# EasyEDA Pro project ProPrj_STM32音响_2025-06-08.epro, schematic 单片机及附属设备

## Sheets
1 INA226&ADS1115: Board Name: PCB6; Create Date: 2025-03-31; Page Name: INA226&ADS1115; Project Name: STM32多功能音响; Schematic Name: 单片机及附属设备; Update Date: 2025-05-01; Company: 嘉立创EDA; Page Size: A4; Version: V1.0
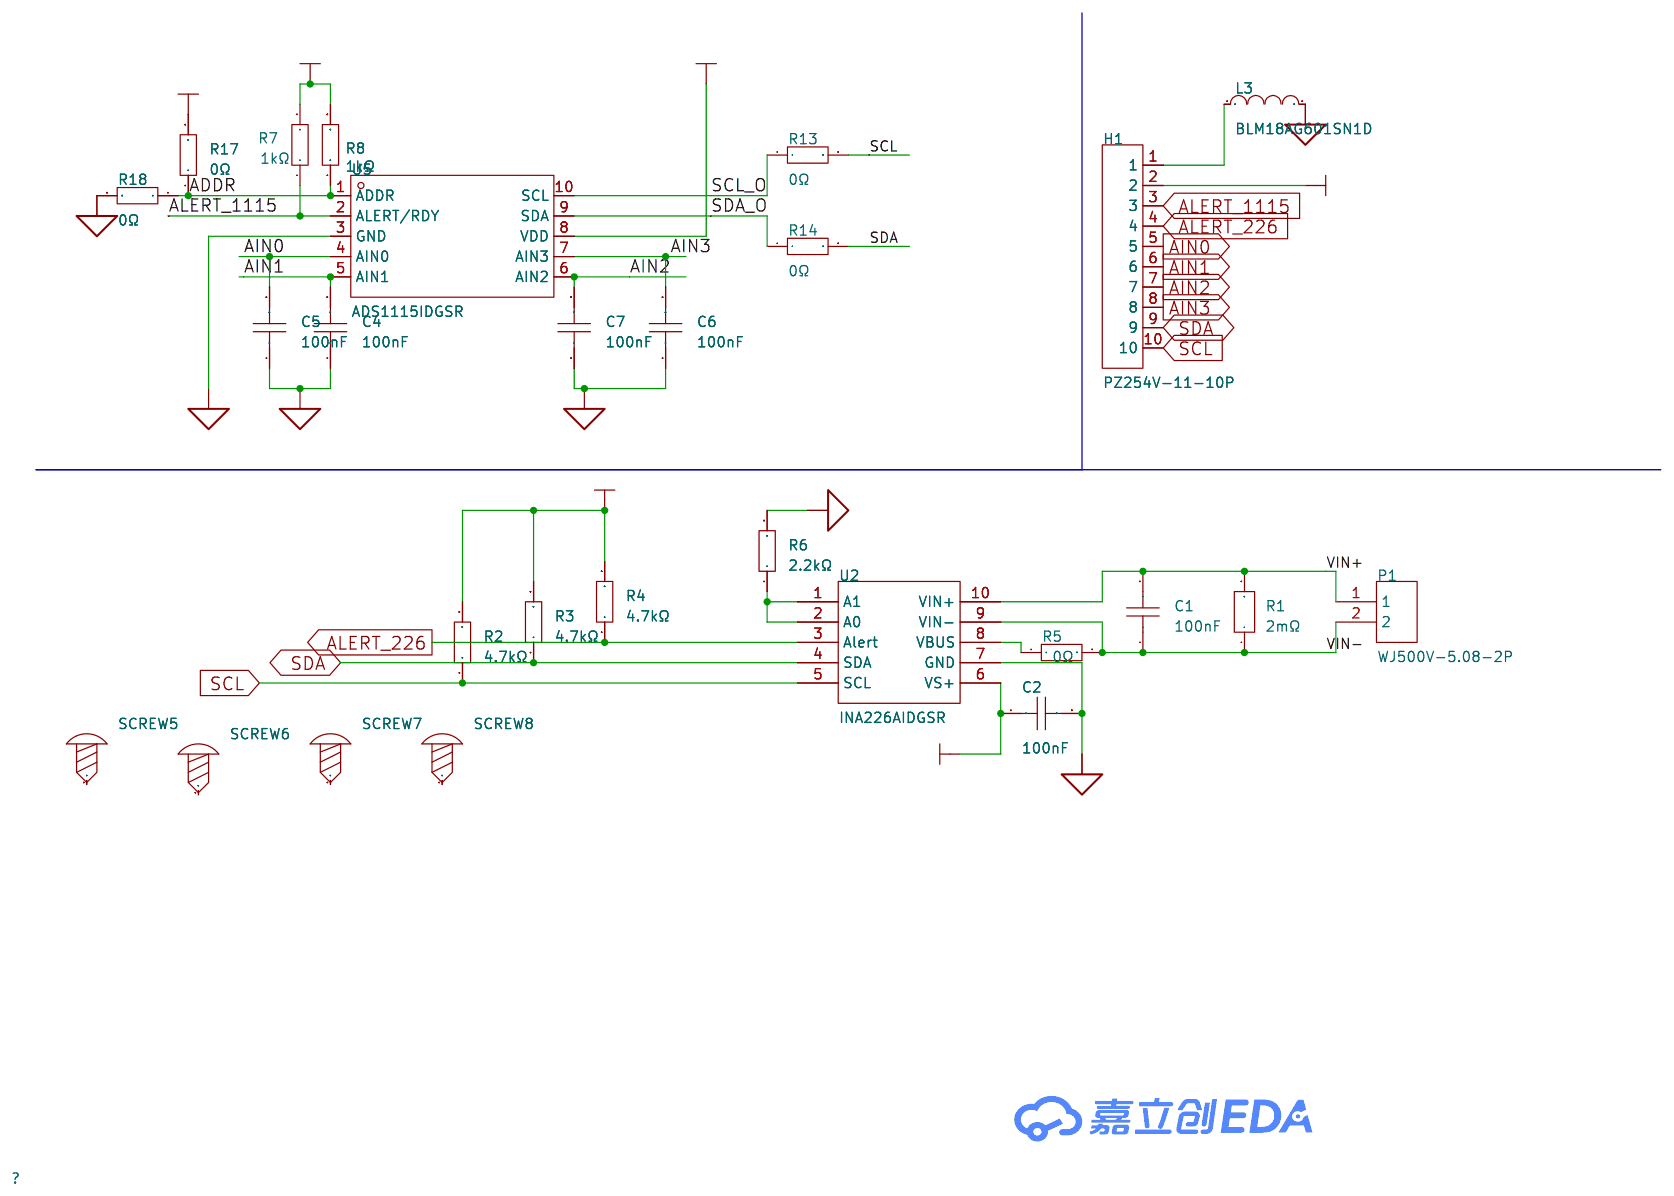
[diagram p13: INA226&ADS1115]
2 音频选择&蓝牙接收&3.3V: Create Date: 2025-05-08; Page Name: P1; Update Date: 2025-05-09
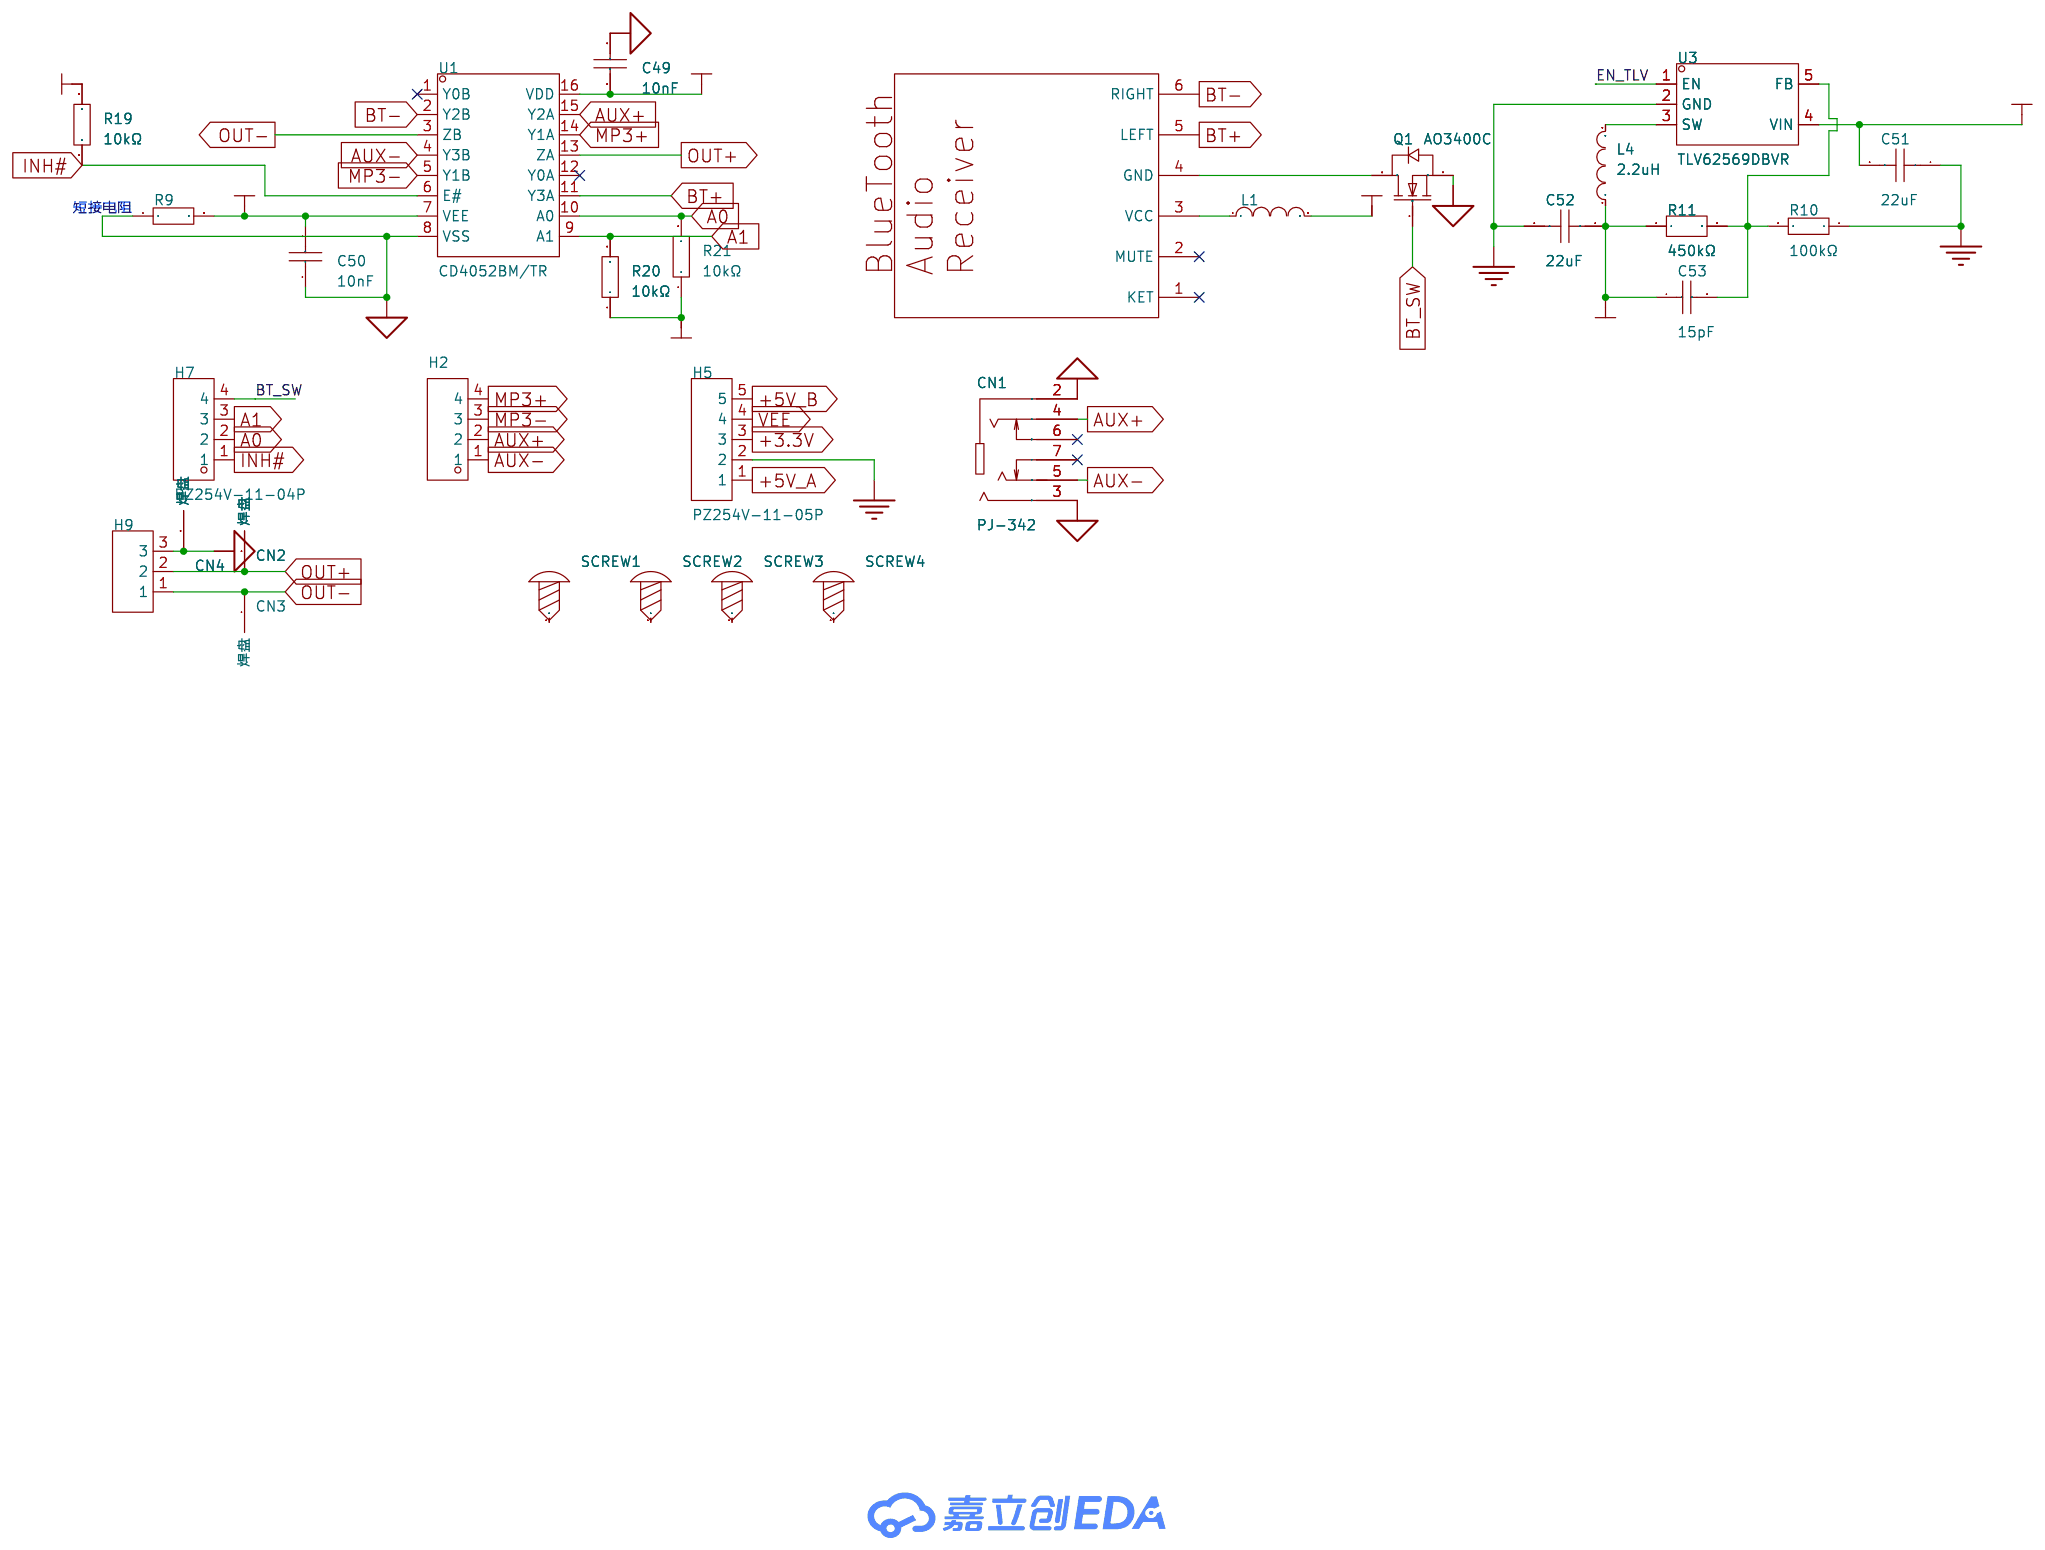
[diagram p14: 音频选择&蓝牙接收&3.3V]

## Parts
sheet INA226&ADS1115
C1  100nF  [C0603]
C2  100nF  [C0603]
C4  100nF  [C0603]
C5  100nF  [C0603]
C6  100nF  [C0603]
C7  100nF  [C0603]
H1  PZ254V-11-10P  [HDR-TH_10P-P2.54-V-M]
L3  BLM18AG601SN1D  [L0603]
P1  WJ500V-5.08-2P  [CONN-TH_2P-P5.00_WJ500V-5.08-2P]
R1  2mΩ  [RES-SMD_L6.4-W3.2-1]
R2  4.7kΩ  [R0603]
R3  4.7kΩ  [R0603]
R4  4.7kΩ  [R0603]
R5  0Ω  [R1206]
R6  2.2kΩ  [R0603]
R7  1kΩ  [R0603]
R8  1kΩ  [R0603]
R13  0Ω  [R0603]
R14  0Ω  [R0603]
R17  0Ω  [R0603]
R18  0Ω  [R0603]
SCREW5  -  [M2螺丝]
SCREW6  -  [M2螺丝]
SCREW7  -  [M2螺丝]
SCREW8  -  [M2螺丝]
U2  INA226AIDGSR  [MSOP-10_L3.0-W3.0-P0.50-LS5.0-BL]
U5  ADS1115IDGSR  [MSOP-10_L3.0-W3.0-P0.50-LS5.0-BL]
sheet 音频选择&蓝牙接收&3.3V
C49  10nF  [C0603]
C50  10nF  [C0603]
C51  22uF  [C1206]
C52  22uF  [C1206]
C53  15pF  [C0603]
CN1  PJ-342  [AUDIO-SMD_PJ-342]
CN2  -  [长圆穿孔焊盘 4-2_1.5-0.75]
CN3  -  [长圆穿孔焊盘 4-2_1.5-0.75]
CN4  -  [长圆穿孔焊盘 4-2_1.5-0.75]
H2  PZ254V-11-04P  [HDR-TH_4P-P2.54-V-M]
H5  PZ254V-11-05P  [HDR-TH_5P-P2.54-V-M]
H7  PZ254V-11-04P  [HDR-TH_4P-P2.54-V-M]
H9  PZ254V-11-03P  [HDR-TH_3P-P2.54-V-M]
L1  BLM18AG601SN1D  [L0603]
L4  2.2uH  [IND-SMD_L7.0-W6.6]
Q1  AO3400C  [SOT-23-3_L2.9-W1.3-P1.90-LS2.4-BR]
R9  0Ω  [R0603]
R10  100kΩ  [R0603]
R11  450kΩ  [R0603]
R19  10kΩ  [R0603]
R20  10kΩ  [R0603]
R21  10kΩ  [R0603]
SCREW1  -  [M2螺丝]
SCREW2  -  [M2螺丝]
SCREW3  -  [M2螺丝]
SCREW4  -  [M2螺丝]
U1  CD4052BM/TR  [SOP-16_L10.0-W3.9-P1.27-LS6.0-BL]
U3  TLV62569DBVR  [SOT-23-5_L3.0-W1.7-P0.95-LS2.8-BR]
U4  -  [M18蓝牙接收器焊盘]

## Library data of the parts
C1 C2 = CGA0603X7R104K500JT: 容值:100nF;精度:±10%;额定电压:50V;材质(温度系数):X7R;; LCSC Part Name: 100nF ±10% 50V; Supplier Part: C6119867; Manufacturer: HRE(芯声); Supplier Footprint: 0603; JLCPCB Part Class: Extended Part; Supplier: LCSC; Tolerance: ±10%; Voltage Rated: 50V; Temperature Coefficient: X7R
C4-C7 = CGA0603X7R104K500JT: 容值:100nF;精度:±10%;额定电压:50V;温度系数:X7R;; LCSC Part Name: 100nF ±10% 50V; Supplier Part: C6119867; Manufacturer: HRE(芯声); Supplier Footprint: 0603; JLCPCB Part Class: Extended Part; Datasheet: https://atta.szlcsc.com/upload/public/pdf/source/20250103/C44077DA9E7B3EFAE02F22B6D3D1CBC9.pdf; Supplier: LCSC; Tolerance: ±10%; Voltage Rated: 50V; Temperature Coefficient: X7R; Voltage Rating: 50V
H1 = PZ254V-11-10P: 插针结构:1x10P;间距:2.54mm;行距:-;圆针/方针:方针;安装方式:直插;排数:单排;总PIN位数:10P;额定电流:-;额定电压:-;配合针长度:6mm;塑高:2.5mm;端接针长度:3mm;触头材质:黄铜;触头镀层:-;工作温度:-40℃~+105℃;颜色:黑色;; LCSC Part Name: 1x10P 间距:2.54mm 方针 直插; Supplier Part: C492409; Manufacturer: XFCN(兴飞); Supplier Footprint: 插件,P=2.54mm; JLCPCB Part Class: Extended Part; Datasheet: https://atta.szlcsc.com/upload/public/pdf/source/20200309/C492409_129C9431BDD62EBBBD0A643B6AAB9FBD.pdf; Supplier: LCSC; Pin Structure: 1x10P; Pitch: 2.54mm; Circluar Pins/Square Pins: 方针; Mounting Type: 直插; Number of Rows: 单排; Number of Pins: 10P; Length of Mating Pin: 6mm; Insulation Height: 2.5mm; Length of End Connection Pin: 3mm; Contact Material: 黄铜; Operating Temperature: -40℃~+105℃; Color: 黑色
L1 L3 = BLM18AG601SN1D: 标称阻抗@测试频率:600Ω@100MHz;误差:±25%;直流电阻(RDC):380mΩ;; LCSC Part Name: 单路 0603磁珠 阻抗600Ω@100MHz; Supplier Part: C19330; Manufacturer: muRata(村田); Supplier Footprint: 0603; JLCPCB Part Class: 扩展库; Datasheet: https://atta.szlcsc.com/upload/public/pdf/source/20180329/C160981_FD3C2D2622A377E203B89F4AA32B0741.pdf; Supplier: LCSC; Impedance @ Frequency: 600Ω@100MHz; Tolerance: ±25%; DC Resistance: 380mΩ; Current Rating: 500mA; Circuits: 1
P1 = WJ500V-5.08-2P: 结构:1x2P;间距:5.08mm;颜色:绿色;安装方式:直插;额定电流:18A;额定电压:250V;排数:1;线规 - AWG:14~30;线规 - 平方毫米:2.5;每排PIN数:2;触头材质:-;触头镀层:-;工作温度范围:-40℃~+105℃;焊接温度(最大值):-;; LCSC Part Name: 1x2P 5.08mm 直插 排数:1 每排P数:2; Supplier Part: C8465; Manufacturer: KANGNEX(康奈克斯电气); Supplier Footprint: 插件,P=5.08mm; JLCPCB Part Class: 扩展库; Datasheet: https://atta.szlcsc.com/upload/public/pdf/source/20191225/C8465_02D34CE5B5B4A53DF5891601D97FA9F4.pdf; Supplier: LCSC; Structure: 1x2P; Pitch: 5.08mm; Color: 绿色; Mounting Style: 直插; Current Rating (Max): 18A; Voltage Rating (Max): 250V; Number of Pins: 2P; Number of Rows: 1; Wire Gauge - AWG: 14~30; Wire Gauge - mm2: 2.5; Number of PINs Per Row: 2; Operating Temperature Range: -40℃~+105℃; Screw Specification: M2.5
R1 = HoLLR2512-3W-2mR-1%: 电阻类型:采样电阻;阻值:2mΩ;精度:±1%;额定压降:-;功率:3W;温度系数:±50ppm/℃;安装方式:贴片;; LCSC Part Name: 2mΩ ±1% 3W; Supplier Part: C2994640; Manufacturer: Milliohm(毫欧); Supplier Footprint: 2512; JLCPCB Part Class: Extended Part; Datasheet: https://atta.szlcsc.com/upload/public/pdf/source/20220330/9E8D3880B1628B3B70C68092C8A7E08B.pdf; Supplier: LCSC; Type: 采样电阻; Tolerance: ±1%; Power(Watts): 3W; Rated Current: 77.5A; Temperature Coefficient: ±50ppm/℃; Mounting Sytle: 贴片
R2-R4 = 0603WAF4701T5E: 电阻类型:厚膜电阻;阻值:4.7kΩ;精度:±1%;功率:100mW;最大工作电压:75V;温度系数:±100ppm/℃;; LCSC Part Name: 4.7kΩ ±1% 100mW 厚膜电阻; Supplier Part: C23162; Manufacturer: UNI-ROYAL(厚声); Supplier Footprint: 0603; JLCPCB Part Class: 基础库; Datasheet: https://atta.szlcsc.com/upload/public/pdf/source/20200306/C422600_1E6D84923E4A46A82E41ADD87F860B5C.pdf; Supplier: LCSC; Type: 厚膜电阻; Tolerance: ±1%; Power(Watts): 100mW; Overload Voltage (Max): 75V; Temperature Coefficient: ±100ppm/℃; Operating Temperature Range: -55℃~+155℃
R5 = 1206W4F0000T5E: 电阻类型:厚膜电阻;阻值:0Ω;精度:±1%;功率:250mW;最大工作电压:200V;温度系数:±800ppm/℃;; LCSC Part Name: 0Ω ±1% 250mW 厚膜电阻; Supplier Part: C17888; Manufacturer: UNI-ROYAL(厚声); Supplier Footprint: 1206; JLCPCB Part Class: 基础库; Datasheet: https://atta.szlcsc.com/upload/public/pdf/source/20200306/C422600_1E6D84923E4A46A82E41ADD87F860B5C.pdf; Supplier: LCSC; Type: 厚膜电阻; Tolerance: ±1%; Power(Watts): 250mW; Overload Voltage (Max): 200V; Temperature Coefficient: ±800ppm/℃; Operating Temperature Range: -55℃~+155℃
R6 = 0603WAF2201T5E: 电阻类型:厚膜电阻;阻值:2.2kΩ;精度:±1%;功率:100mW;最大工作电压:75V;温度系数:±100ppm/℃;; LCSC Part Name: 2.2kΩ ±1% 100mW 厚膜电阻; Supplier Part: C4190; Manufacturer: UNI-ROYAL(厚声); Supplier Footprint: 0603; JLCPCB Part Class: Basic Part; Datasheet: https://atta.szlcsc.com/upload/public/pdf/source/20200306/C422600_1E6D84923E4A46A82E41ADD87F860B5C.pdf; Supplier: LCSC; Type: 厚膜电阻; Tolerance: ±1%; Power(Watts): 100mW; Overload Voltage (Max): 75V; Temperature Coefficient: ±100ppm/℃; Operating Temperature Range: -55℃~+155℃
R7 R8 = 0603WAF1001T5E: 电阻类型:厚膜电阻;阻值:1kΩ;精度:±1%;功率:100mW;最大工作电压:75V;温度系数:±100ppm/℃;; LCSC Part Name: 1kΩ ±1% 100mW 厚膜电阻; Supplier Part: C21190; Manufacturer: UNI-ROYAL(厚声); Supplier Footprint: 0603; JLCPCB Part Class: Basic Part; Datasheet: https://atta.szlcsc.com/upload/public/pdf/source/20200306/C422600_1E6D84923E4A46A82E41ADD87F860B5C.pdf; Supplier: LCSC; Type: 厚膜电阻; Tolerance: ±1%; Power(Watts): 100mW; Overload Voltage (Max): 75V; Temperature Coefficient: ±100ppm/℃; Operating Temperature Range: -55℃~+155℃
R9 R13 R14 R17 R18 = 0603WAF0000T5E: 电阻类型:厚膜电阻;阻值:0Ω;精度:±1%;功率:100mW;最大工作电压:75V;; LCSC Part Name: 0Ω ±1% 100mW 厚膜电阻; Supplier Part: C21189; Manufacturer: UNI-ROYAL(厚声); Supplier Footprint: 0603; JLCPCB Part Class: 基础库; Datasheet: https://atta.szlcsc.com/upload/public/pdf/source/20200306/C422600_1E6D84923E4A46A82E41ADD87F860B5C.pdf; Supplier: LCSC; Type: 厚膜电阻; Tolerance: ±1%; Power(Watts): 100mW; Overload Voltage (Max): 75V; Operating Temperature Range: -55℃~+155℃
SCREW1-SCREW8 = M2螺丝: Supplier Footprint: 插件
U2 = INA226AIDGSR: INA226 支持报警功能的 36V、双向、超高精度、低侧/高侧、I2C 输出电流/功率监控器; Supplier Part: C49851; Manufacturer: TI(德州仪器); Supplier Footprint: MSOP-10; JLCPCB Part Class: Extended Part; Datasheet: https://www.ti.com/cn/lit/gpn/ina226; Supplier: LCSC; Supply Voltage: 0V~36V; Operating Temperature: -40℃~+125℃
U5 = ADS1115IDGSR: 接口:I2C;电源电压:2V~5.5V;采样率:860Hz;分辨率:16位;; LCSC Part Name: 具有内部基准、振荡器和可编程比较器且兼容 I2C 的ADS111x、超小型、低功耗 860SPS、16位ADC; Supplier Part: C37593; Manufacturer: TI(德州仪器); Supplier Footprint: VSSOP-10; JLCPCB Part Class: 扩展库; Datasheet: https://www.ti.com/cn/lit/gpn/ads1115; Supplier: LCSC; Interface: I2C; differential input: 是; number of channels: 2; Supply Voltage: 2V~5.5V; sampling frequency: 860Hz; resolution: 16位; Operating Temperature: -40℃~+125℃
C49 C50 = CC0603KRX7R9BB103: 容值:10nF;精度:±10%;额定电压:50V;材质(温度系数):X7R;; LCSC Part Name: 10nF ±10% 50V; Supplier Part: C100042; Manufacturer: YAGEO(国巨); Supplier Footprint: 0603; JLCPCB Part Class: 扩展库; Datasheet: https://atta.szlcsc.com/upload/public/pdf/source/20181008/C309510_22F155564471FAF6A489F7D68F34234E.pdf; Supplier: LCSC; Tolerance: ±10%; Voltage Rated: 50V; Temperature Coefficient: X7R
C51 C52 = CGA1206X5R226M350NT: 容值:22uF;精度:±20%;额定电压:35V;温度系数:X5R;; LCSC Part Name: 22uF ±20% 35V; Supplier Part: C6119969; Manufacturer: HRE(芯声); Supplier Footprint: 1206; JLCPCB Part Class: 扩展库; Supplier: LCSC; Tolerance: ±20%; Voltage Rating: 35V; Temperature Coefficient: X5R
C53 = CL10C150JB8NNNC: 容值:15pF;精度:±5%;额定电压:50V;材质(温度系数):C0G;; LCSC Part Name: 15pF ±5% 50V; Supplier Part: C1644; Manufacturer: SAMSUNG(三星); Supplier Footprint: 0603; JLCPCB Part Class: Basic Part; Datasheet: https://atta.szlcsc.com/upload/public/pdf/source/20160218/1457707763339.pdf; Supplier: LCSC; Tolerance: ±5%; Voltage Rated: 50V; Temperature Coefficient: C0G
CN1 = PJ-342_C668606: 连接器类型:3.5mm耳机座;额定电流:500mA;额定电压:30V;工作温度范围:-30℃~+70℃;; LCSC Part Name: 3.5mm耳机座; Supplier Part: C668606; Manufacturer: SHOU HAN(首韩); Supplier Footprint: SMD; JLCPCB Part Class: 扩展库; Datasheet: https://atta.szlcsc.com/upload/public/pdf/source/20200618/C668606_D9051A7D9D1D8CCDEAA76A8E7BC279ED.pdf; Supplier: LCSC; Connector Type: 3.5mm耳机座; Current Rating (Max): 500mA; Voltage Rating (Max): 30V; Operating Temperature Range: -30℃~+70℃
CN2-CN4 = 长圆穿孔焊盘 4-2_1.5-0.75
H2 H7 = PZ254V-11-04P: 插针结构:1x4P;间距:2.54mm;行距:-;圆针/方针:方针;安装类型:直插;排数:单排;总PIN位数:4P;额定电流:3A;额定电压:250V;配合针长度:6mm;塑高:2.5mm;端接针长度:3mm;触头材质:-;工作温度范围:-40℃~+105℃;颜色:黑色;; LCSC Part Name: 间距:2.54mm 1x4P 直插 方针; Supplier Part: C2691448; Manufacturer: XFCN(兴飞); Supplier Footprint: 插件,P=2.54mm; JLCPCB Part Class: Extended Part; Datasheet: https://atta.szlcsc.com/upload/public/pdf/source/20200309/C492403_F9F19131791D08044AD4F84F8E751A34.pdf; Supplier: LCSC; Pin Structure: 1x4P; Pitch: 2.54mm; Circluar Pins/Square Pins: 方针; Mounting Type: 直插; Number of Rows: 单排; Number of Pins: 4P; Current Rating (Max): 3A; Voltage Rating (Max): 250V; Length of Mating Pin: 6mm; Insulation Height: 2.5mm; Length of End Connection Pin: 3mm; Operating Temperature Range: -40℃~+105℃; Color: 黑色
H5 = PZ254V-11-05P: 插针结构:1x5P;间距:2.54mm;行距:-;圆针/方针:方针;安装方式:直插;排数:单排;总PIN位数:5P;额定电流:-;额定电压:-;配合针长度:6mm;塑高:2.5mm;端接针长度:3mm;触头材质:黄铜;触头镀层:-;工作温度:-40℃~+105℃;颜色:黑色;; LCSC Part Name: 1x5P 间距:2.54mm 方针 直插; Supplier Part: C492404; Manufacturer: XFCN(兴飞); Supplier Footprint: 插件,P=2.54mm; JLCPCB Part Class: 扩展库; Datasheet: https://atta.szlcsc.com/upload/public/pdf/source/20200309/C492404_E51533260F8710EFF5D4617281164C1D.pdf; Supplier: LCSC; Pin Structure: 1x5P; Pitch: 2.54mm; Circluar Pins/Square Pins: 方针; Mounting Type: 直插; Number of Rows: 单排; Number of Pins: 5P; Length of Mating Pin: 6mm; Insulation Height: 2.5mm; Length of End Connection Pin: 3mm; Contact Material: 黄铜; Operating Temperature: -40℃~+105℃; Color: 黑色
H9 = PZ254V-11-03P: 插针结构:1x3P;间距:2.54mm;行距:-;圆针/方针:方针;安装方式:直插;排数:单排;总PIN位数:3P;额定电流:3A;额定电压:250V;配合针长度:6mm;塑高:2.5mm;端接针长度:3mm;工作温度:-40℃~+105℃;颜色:黑色;; LCSC Part Name: 1x3P 间距:2.54mm 方针 直插; Supplier Part: C2937625; Manufacturer: XFCN(兴飞); Supplier Footprint: 插件,P=2.54mm; JLCPCB Part Class: Extended Part; Datasheet: https://atta.szlcsc.com/upload/public/pdf/source/20200309/C492402_8335C3D49C4E4C618838D59BB1D024C1.pdf; Supplier: LCSC; Pin Structure: 1x3P; Pitch: 2.54mm; Circluar Pins/Square Pins: 方针; Mounting Type: 直插; Number of Rows: 单排; Number of Pins: 3P; Current Rating: 3A; Voltage Rating (Max): 250V; Length of Mating Pin: 6mm; Insulation Height: 2.5mm; Length of End Connection Pin: 3mm; Operating Temperature: -40℃~+105℃; Color: 黑色
L4 = FXL0630-2R2-M: 电感值:2.2uH;精度:±20%;额定电流:9.5A;饱和电流(Isat):10A;类型:一体成型电感;; LCSC Part Name: 2.2uH ±20% 10A; Supplier Part: C167218; Manufacturer: cjiang(长江微电); Supplier Footprint: SMD,6.6x7mm; JLCPCB Part Class: 扩展库; Datasheet: https://atta.szlcsc.com/upload/public/pdf/source/20240426/3189EA8206330E2108542F9E34E540E7.pdf; Supplier: LCSC; Tolerance: ±20%; Rated Current: 9.5A; Saturation Current (Isat): 10A; DC Resistance (DCR): 15mΩ; Type: 一体成型电感
Q1 = AO3400C: 类型:1个N沟道;漏源电压(Vdss):30V;连续漏极电流(Id):6.2A;导通电阻(RDS(on)):20mΩ@4.5V,5.5A;耗散功率(Pd):-;阈值电压(Vgs(th)):1.3V;; LCSC Part Name: 1个N沟道 耐压:30V 电流:6.2A; Supplier Part: C541722; Manufacturer: AOS; Supplier Footprint: SOT-23; JLCPCB Part Class: 扩展库; Datasheet: https://atta.szlcsc.com/upload/public/pdf/source/20200908/C541722_AFBFDB26E86D8C1A63F798809401D99A.pdf; Supplier: LCSC; Type: 1个N沟道; Drain to Source Voltage: 30V; Current - Continuous Drain(Id): 6.2A; RDS(on): 20mΩ@4.5V,5.5A; Gate Threshold Voltage (Vgs(th)@Id): 1.3V; Gate Charge(Qg): 12nC@10V; Input Capacitance(Ciss@Vds): 600pF@15V; Reverse Transfer Capacitance (Crss@Vds): 60pF@15V; Operating Temperature: -55℃~+150℃
R10 = 0603WAF1003T5E: 电阻类型:厚膜电阻;阻值:100kΩ;精度:±1%;功率:100mW;最大工作电压:75V;温度系数:±100ppm/℃;; LCSC Part Name: 100kΩ ±1% 100mW 厚膜电阻; Supplier Part: C25803; Manufacturer: UNI-ROYAL(厚声); Supplier Footprint: 0603; JLCPCB Part Class: Basic Part; Datasheet: https://atta.szlcsc.com/upload/public/pdf/source/20200306/C422600_1E6D84923E4A46A82E41ADD87F860B5C.pdf; Supplier: LCSC; Type: 厚膜电阻; Tolerance: ±1%; Power(Watts): 100mW; Overload Voltage (Max): 75V; Temperature Coefficient: ±100ppm/℃; Operating Temperature Range: -55℃~+155℃
R11 = FRC0402F4503TS: 电阻类型:厚膜电阻;阻值:450kΩ;精度:±1%;功率:62.5mW;最大工作电压:50V;温度系数:±100ppm/℃;; LCSC Part Name: 450kΩ ±1% 62.5mW 厚膜电阻; Supplier Part: C5159688; Manufacturer: FOJAN(富捷); Supplier Footprint: 0402; JLCPCB Part Class: Extended Part; Datasheet: https://atta.szlcsc.com/upload/public/pdf/source/20211221/925EC7D7225764EE0046F22065062C87.pdf; Supplier: LCSC; Type: 厚膜电阻; Tolerance: ±1%; Power(Watts): 62.5mW; Overload Voltage (Max): 50V; Temperature Coefficient: ±100ppm/℃
R19-R21 = 0603WAF1002T5E: 电阻类型:厚膜电阻;阻值:10kΩ;精度:±1%;功率:100mW;最大工作电压:75V;温度系数:±100ppm/℃;; LCSC Part Name: 厚膜电阻 10kΩ ±1% 100mW; Supplier Part: C25804; Manufacturer: UNI-ROYAL(厚声); Supplier Footprint: 0603; JLCPCB Part Class: 基础库; Datasheet: https://atta.szlcsc.com/upload/public/pdf/source/20200306/C422600_1E6D84923E4A46A82E41ADD87F860B5C.pdf; Supplier: LCSC; Type: 厚膜电阻; Tolerance: ±1%; Power(Watts): 100mW; Overload Voltage (Max): 75V; Temperature Coefficient: ±100ppm/℃; Operating Temperature Range: -55℃~+155℃
U1 = CD4052BM/TR: 开关电路:单刀四掷(SP4T);通道数:4;导通电阻(Ron@VCC):60Ω;; LCSC Part Name: CMOS 两路差分四通道多路复用器; Supplier Part: C253890; Manufacturer: HGSEMI(华冠); Supplier Footprint: SOP-16; JLCPCB Part Class: 扩展库; Datasheet: https://atta.szlcsc.com/upload/public/pdf/source/20240903/DE3385D0C4CE35B8896B814D9A99AFF3.pdf; Supplier: LCSC; Switch Circuit: 单刀四掷(SP4T); Number of Channels: 4; Supply Voltage: 3V~15V; On-State Resistance (Max): 60Ω; Operating Temperature: -40℃~+85℃
U3 = TLV62569DBVR: 功能类型:降压型;输出类型:可调;工作电压:2.5V~5.5V;输出电压:600mV~5.5V;输出电流:2A;; LCSC Part Name: 高效率同步降压转换器; Supplier Part: C141836; Manufacturer: TI(德州仪器); Supplier Footprint: SOT-23-5; JLCPCB Part Class: 扩展库; Datasheet: https://www.ti.com/cn/lit/gpn/tlv62569; Supplier: LCSC; Function: 降压型; Output Type: 可调; Input Voltage: 2.5V~5.5V; Output Voltage: 600mV~5.5V; Output Current: 2A; Switching Frequency: 1.5MHz; Operating Temperature: -40℃~+125℃@(TJ); Synchronous Rectification: 是; Topology: 降压式; Switch tube (built-in/external): 内置
U4 = M18蓝牙接收器

## Nets
+3.3V: C2.1 C52.1 C53.1 H1.2 H5.3 L4.1 R2.2 R3.2 R4.2 R7.2 R8.2 R11.1 R17.2 U2.6(VS+) U5.8(VDD)
+5V_A: C51.2 H5.1 L1.2 U3.4(VIN)
+5V_B: C49.1 H5.5 R19.2 R20.1 R21.1 U1.16(VDD)
AGND: C2.2 C4.1 C5.1 C6.1 C7.1 C49.2 C50.1 CN1.2 CN1.3 CN4.1(焊盘) H9.3 L3.2 Q1.2(S) R6.2 R9.1 R18.2 U1.8(VSS) U2.7(GND) U5.3(GND)
GND: C51.1 C52.2 H5.2 R10.1 U3.2(GND)
VEE: C50.2 H5.4 R9.2 U1.7(VEE)
VIN+: C1.2 P1.1 R1.2 U2.10(VIN+)
VIN-: C1.1 P1.2 R1.1 R5.2 U2.9(VIN-)
A0: H7.2 R21.2 U1.10(A0)
A1: H7.3 R20.2 U1.9(A1)
ADDR: R8.1 R17.1 R18.1 U5.1(ADDR)
AIN0: C5.2 H1.5 U5.4(AIN0)
AIN1: C4.2 H1.6 U5.5(AIN1)
AIN2: C7.2 H1.7 U5.6(AIN2)
AIN3: C6.2 H1.8 U5.7(AIN3)
ALERT_226: H1.4 R4.1 U2.3(Alert)
ALERT_1115: H1.3 R7.1 U5.2(ALERT/RDY)
AUX+: CN1.4 H2.2 U1.15(Y2A)
AUX-: CN1.5 H2.1 U1.4(Y3B)
BT+: U1.11(Y3A) U4.5(LEFT)
BT-: U1.2(Y2B) U4.6(RIGHT)
BT_SW: H7.4 Q1.1(G)
EN_TLV: U3.1(EN)
INH#: H7.1 R19.1 U1.6(E#)
MP3+: H2.4 U1.14(Y1A)
MP3-: H2.3 U1.5(Y1B)
OUT+: CN2.1(焊盘) H9.2 U1.13(ZA)
OUT-: CN3.1(焊盘) H9.1 U1.3(ZB)
SCL: H1.10 R2.1 R13.2 U2.5(SCL)
SCL_O: R13.1 U5.10(SCL)
SDA: H1.9 R3.1 R14.2 U2.4(SDA)
SDA_O: R14.1 U5.9(SDA)
$1N964: R5.1 U2.8(VBUS)
$1N970: R6.1 U2.1(A1) U2.2(A0)
$1N983: H1.1 L3.1
$3N1532: L1.1 U4.3(VCC)
$3N2020: C53.2 R10.2 R11.2 U3.5(FB)
$3N6590: L4.2 U3.3(SW)
$3N7759: Q1.3(D) U4.4(GND)

Not connected (* = marked no-connect by the designer): CN1 6* 7*; SCREW1 1; SCREW2 1; SCREW3 1; SCREW4 1; SCREW5 1; SCREW6 1; SCREW7 1; SCREW8 1; U1 1(Y0B)* 12(Y0A)*; U4 1(KET)* 2(MUTE)*

## Notes on the sheets
sheet 2
- 短接电阻
